# EAGLE schematic Thomas (EAGLE 7.6.0)
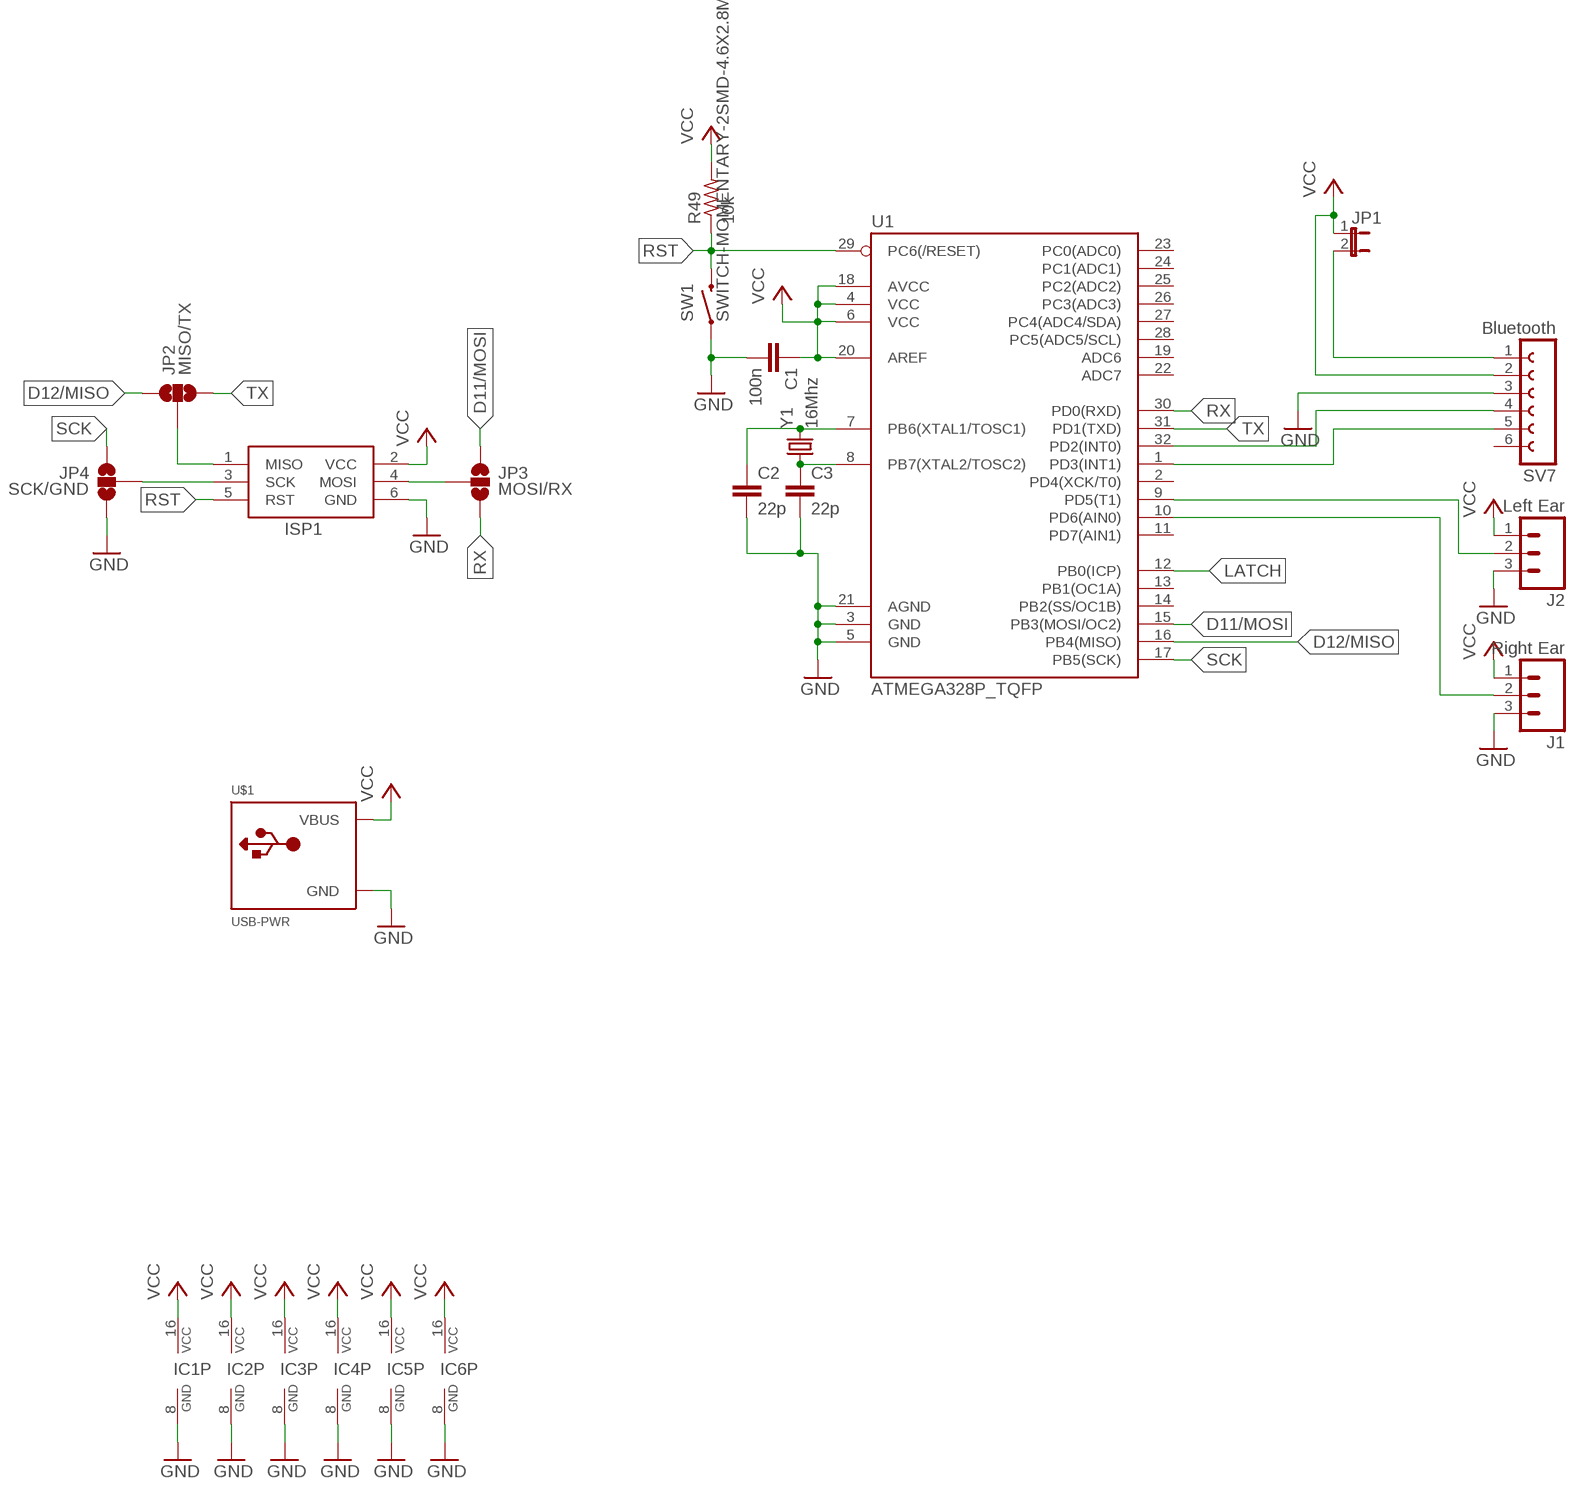
[diagram p0: schematic, sheet 1, part 1 of 2]
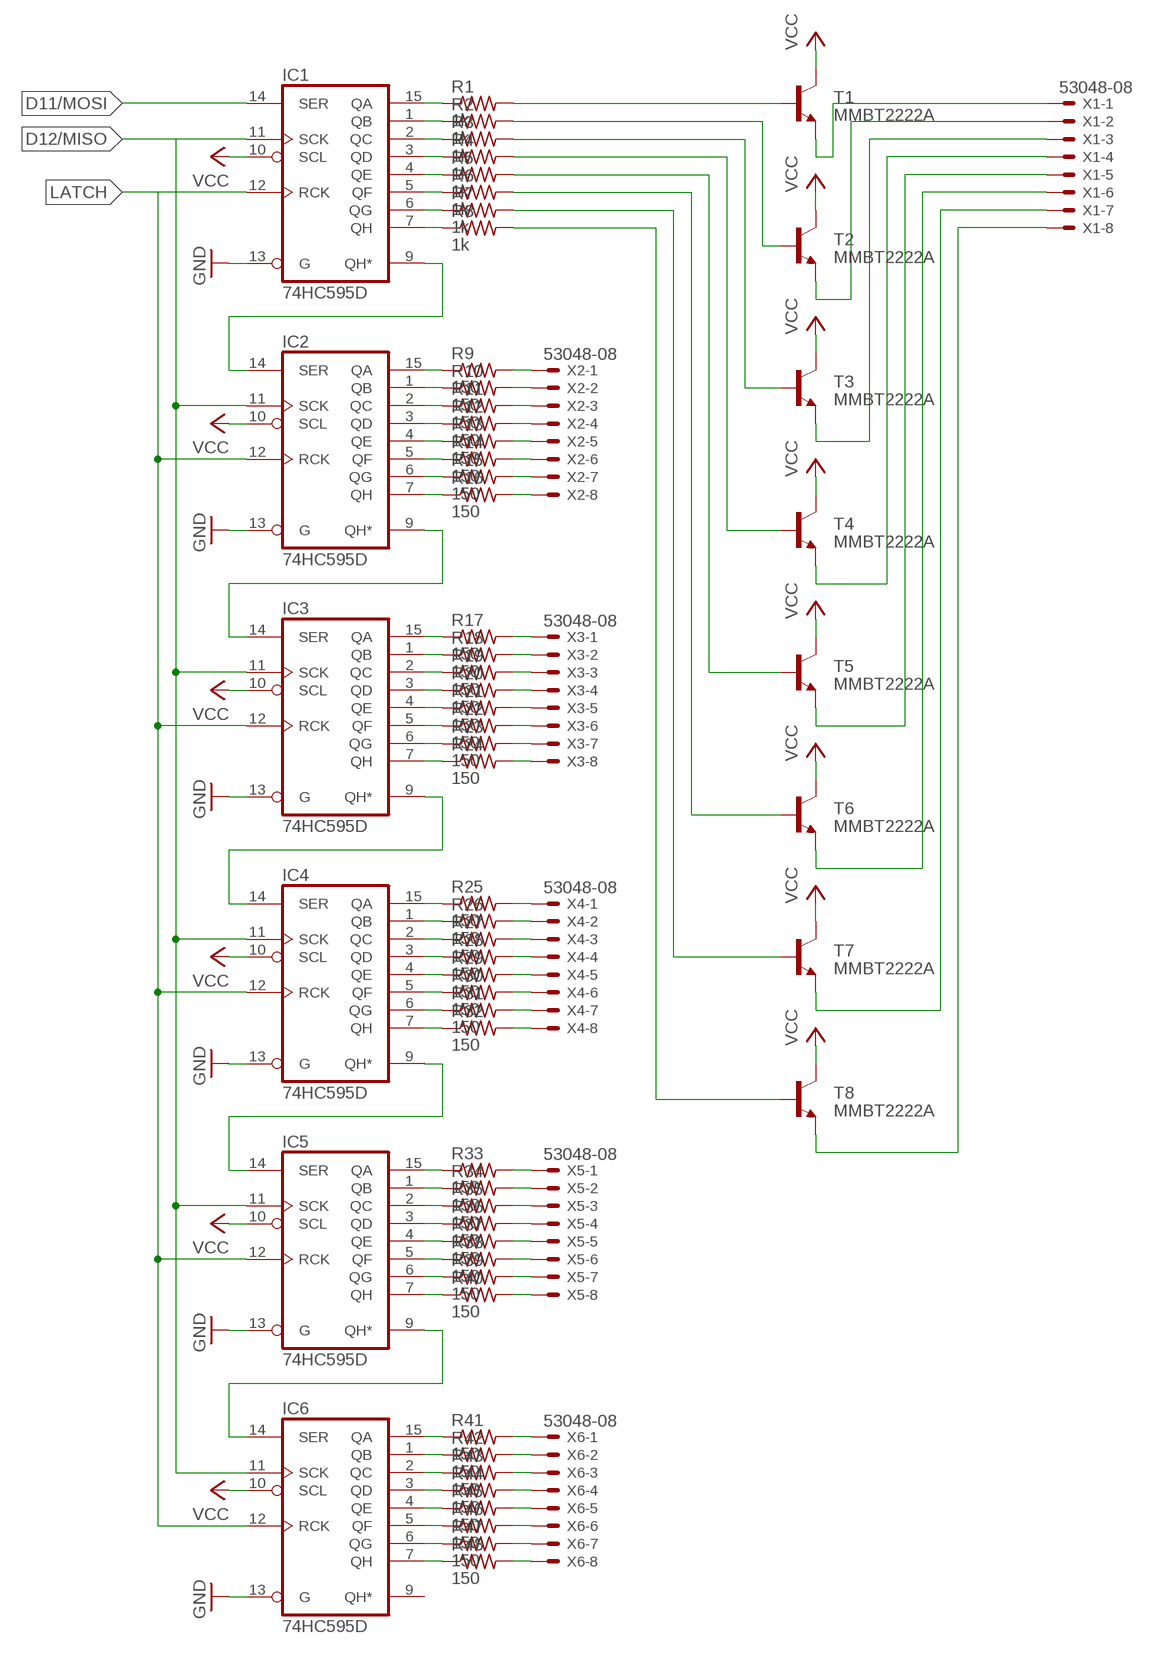
[diagram p1: schematic, sheet 1, part 2 of 2]

## Parts
C1  100n  C-EUC0805K  [C0805K]
C2  22p  C-EUC0805K  [C0805K]
C3  22p  C-EUC0805K  [C0805K]
IC1  74HC595D  [SO16]
IC2  74HC595D  [SO16]
IC3  74HC595D  [SO16]
IC4  74HC595D  [SO16]
IC5  74HC595D  [SO16]
IC6  74HC595D  [SO16]
ISP1  AVRISP-6  [AVRISP]
J1  Right Ear  M03PTH  [1X03]
J2  Left Ear  M03PTH  [1X03]
JP1  JUMPER-2SMD-NC  [SJ_2S]
JP2  MISO/TX  JUMPER-PAD-3-NOYES_SILK  [PAD-JUMPER-3-NO_YES_SILK]
JP3  MOSI/RX  JUMPER-PAD-3-NOYES_SILK  [PAD-JUMPER-3-NO_YES_SILK]
JP4  SCK/GND  JUMPER-PAD-3-NOYES_SILK  [PAD-JUMPER-3-NO_YES_SILK]
R1  1k  R-US_R0805  [R0805]
R2  1k  R-US_R0805  [R0805]
R3  1k  R-US_R0805  [R0805]
R4  1k  R-US_R0805  [R0805]
R5  1k  R-US_R0805  [R0805]
R6  1k  R-US_R0805  [R0805]
R7  1k  R-US_R0805  [R0805]
R8  1k  R-US_R0805  [R0805]
R9  150  R-US_R0805  [R0805]
R10  150  R-US_R0805  [R0805]
R11  150  R-US_R0805  [R0805]
R12  150  R-US_R0805  [R0805]
R13  150  R-US_R0805  [R0805]
R14  150  R-US_R0805  [R0805]
R15  150  R-US_R0805  [R0805]
R16  150  R-US_R0805  [R0805]
R17  150  R-US_R0805  [R0805]
R18  150  R-US_R0805  [R0805]
R19  150  R-US_R0805  [R0805]
R20  150  R-US_R0805  [R0805]
R21  150  R-US_R0805  [R0805]
R22  150  R-US_R0805  [R0805]
R23  150  R-US_R0805  [R0805]
R24  150  R-US_R0805  [R0805]
R25  150  R-US_R0805  [R0805]
R26  150  R-US_R0805  [R0805]
R27  150  R-US_R0805  [R0805]
R28  150  R-US_R0805  [R0805]
R29  150  R-US_R0805  [R0805]
R30  150  R-US_R0805  [R0805]
R31  150  R-US_R0805  [R0805]
R32  150  R-US_R0805  [R0805]
R33  150  R-US_R0805  [R0805]
R34  150  R-US_R0805  [R0805]
R35  150  R-US_R0805  [R0805]
R36  150  R-US_R0805  [R0805]
R37  150  R-US_R0805  [R0805]
R38  150  R-US_R0805  [R0805]
R39  150  R-US_R0805  [R0805]
R40  150  R-US_R0805  [R0805]
R41  150  R-US_R0805  [R0805]
R42  150  R-US_R0805  [R0805]
R43  150  R-US_R0805  [R0805]
R44  150  R-US_R0805  [R0805]
R45  150  R-US_R0805  [R0805]
R46  150  R-US_R0805  [R0805]
R47  150  R-US_R0805  [R0805]
R48  150  R-US_R0805  [R0805]
R49  10k  R-US_R0805  [R0805]
SV7  Bluetooth  FE06-1  [FE06]
SW1  SWITCH-MOMENTARY-2SMD-4.6X2.8MM  [TACTILE_SWITCH_SMD_4.6X2.8MM]
T1  MMBT2222A  TRANSISTOR_NPNMMBT2222A  [SOT23-3]
T2  MMBT2222A  TRANSISTOR_NPNMMBT2222A  [SOT23-3]
T3  MMBT2222A  TRANSISTOR_NPNMMBT2222A  [SOT23-3]
T4  MMBT2222A  TRANSISTOR_NPNMMBT2222A  [SOT23-3]
T5  MMBT2222A  TRANSISTOR_NPNMMBT2222A  [SOT23-3]
T6  MMBT2222A  TRANSISTOR_NPNMMBT2222A  [SOT23-3]
T7  MMBT2222A  TRANSISTOR_NPNMMBT2222A  [SOT23-3]
T8  MMBT2222A  TRANSISTOR_NPNMMBT2222A  [SOT23-3]
U1  ATMEGA328P_TQFP  [TQFP32-08]
U$1  USB-PWR  [USB-MINIB-THM-MOLEX-PWRONLY]
X1  53048-08  [53048-08]
X2  53048-08  [53048-08]
X3  53048-08  [53048-08]
X4  53048-08  [53048-08]
X5  53048-08  [53048-08]
X6  53048-08  [53048-08]
Y1  16Mhz  CRYSTAL3.2X1.5MM  [CRYSTAL-SMD-3.2X1.5MM]

## Nets
D11/MOSI: IC1.14(SER) JP3.1 U1.15(PB3(MOSI/OC2))
D12/MISO: IC1.11(SCK) IC2.11(SCK) IC3.11(SCK) IC4.11(SCK) IC5.11(SCK) IC6.11(SCK) JP2.1 U1.16(PB4(MISO))
GND: C1.2 C2.2 C3.2 IC1.8(GND) IC1.13(G) IC2.8(GND) IC2.13(G) IC3.8(GND) IC3.13(G) IC4.8(GND) IC4.13(G) IC5.8(GND) IC5.13(G) IC6.8(GND) IC6.13(G) ISP1.6(GND) J1.3 J2.3 JP4.3 SV7.3 SW1.1 SW1.2 U1.3(GND) U1.5(GND) U1.21(AGND) U$1.GND
LATCH: IC1.12(RCK) IC2.12(RCK) IC3.12(RCK) IC4.12(RCK) IC5.12(RCK) IC6.12(RCK) U1.12(PB0(ICP))
N$1: IC1.9(QH*) IC2.14(SER)
N$2: IC2.9(QH*) IC3.14(SER)
N$3: IC3.9(QH*) IC4.14(SER)
N$4: IC4.9(QH*) IC5.14(SER)
N$5: IC5.9(QH*) IC6.14(SER)
N$6: R41.2 X6.1
N$7: R42.2 X6.2
N$8: R43.2 X6.3
N$9: R44.2 X6.4
N$10: R45.2 X6.5
N$11: R46.2 X6.6
N$12: R47.2 X6.7
N$13: R48.2 X6.8
N$14: R33.2 X5.1
N$15: R34.2 X5.2
N$16: R35.2 X5.3
N$17: R36.2 X5.4
N$18: R37.2 X5.5
N$19: R38.2 X5.6
N$20: R39.2 X5.7
N$21: R40.2 X5.8
N$22: R25.2 X4.1
N$23: R26.2 X4.2
N$24: R27.2 X4.3
N$25: R28.2 X4.4
N$26: R29.2 X4.5
N$27: R30.2 X4.6
N$28: R31.2 X4.7
N$29: R32.2 X4.8
N$30: R17.2 X3.1
N$31: R18.2 X3.2
N$32: R19.2 X3.3
N$33: R20.2 X3.4
N$34: R21.2 X3.5
N$35: R22.2 X3.6
N$36: R23.2 X3.7
N$37: R24.2 X3.8
N$38: R9.2 X2.1
N$39: R10.2 X2.2
N$40: R11.2 X2.3
N$41: R12.2 X2.4
N$42: R13.2 X2.5
N$43: R14.2 X2.6
N$44: R15.2 X2.7
N$45: R16.2 X2.8
N$46: JP1.2 SV7.1
N$47: SV7.4 U1.32(PD2(INT0))
N$48: IC2.15(QA) R9.1
N$49: IC2.1(QB) R10.1
N$50: IC2.2(QC) R11.1
N$51: IC2.3(QD) R12.1
N$52: IC2.4(QE) R13.1
N$53: IC2.5(QF) R14.1
N$54: IC2.6(QG) R15.1
N$55: IC2.7(QH) R16.1
N$56: IC3.15(QA) R17.1
N$57: IC3.1(QB) R18.1
N$58: IC3.2(QC) R19.1
N$59: IC3.3(QD) R20.1
N$60: IC3.4(QE) R21.1
N$61: IC3.5(QF) R22.1
N$62: IC3.6(QG) R23.1
N$63: IC3.7(QH) R24.1
N$64: IC4.15(QA) R25.1
N$65: IC4.1(QB) R26.1
N$66: IC4.2(QC) R27.1
N$67: IC4.3(QD) R28.1
N$68: IC4.4(QE) R29.1
N$69: IC4.5(QF) R30.1
N$70: IC4.6(QG) R31.1
N$71: IC4.7(QH) R32.1
N$72: IC5.15(QA) R33.1
N$73: IC5.1(QB) R34.1
N$74: IC5.2(QC) R35.1
N$75: IC5.3(QD) R36.1
N$76: IC5.4(QE) R37.1
N$77: IC5.5(QF) R38.1
N$78: IC5.6(QG) R39.1
N$79: IC5.7(QH) R40.1
N$80: IC6.15(QA) R41.1
N$81: IC6.1(QB) R42.1
N$82: IC6.2(QC) R43.1
N$83: IC6.3(QD) R44.1
N$84: IC6.4(QE) R45.1
N$85: IC6.5(QF) R46.1
N$86: IC6.6(QG) R47.1
N$87: IC6.7(QH) R48.1
N$88: IC1.15(QA) R1.1
N$89: IC1.1(QB) R2.1
N$90: IC1.2(QC) R3.1
N$91: IC1.3(QD) R4.1
N$92: IC1.4(QE) R5.1
N$93: IC1.5(QF) R6.1
N$94: IC1.6(QG) R7.1
N$95: IC1.7(QH) R8.1
N$96: R1.2 T1.1(B)
N$97: R2.2 T2.1(B)
N$98: R3.2 T3.1(B)
N$99: R4.2 T4.1(B)
N$100: R5.2 T5.1(B)
N$101: R6.2 T6.1(B)
N$102: R7.2 T7.1(B)
N$103: R8.2 T8.1(B)
N$104: T1.2(E) X1.1
N$105: T2.2(E) X1.2
N$106: T3.2(E) X1.3
N$107: T4.2(E) X1.4
N$108: T5.2(E) X1.5
N$109: T6.2(E) X1.6
N$110: T7.2(E) X1.7
N$111: T8.2(E) X1.8
N$112: SV7.5 U1.1(PD3(INT1))
N$113: C2.1 U1.7(PB6(XTAL1/TOSC1)) Y1.P$2
N$114: C3.1 U1.8(PB7(XTAL2/TOSC2)) Y1.P$1
N$115: J2.2 U1.9(PD5(T1))
N$116: J1.2 U1.10(PD6(AIN0))
N$117: ISP1.1(MISO) JP2.2
N$118: ISP1.3(SCK) JP4.2
N$119: ISP1.4(MOSI) JP3.2
RST: ISP1.5(RST) R49.1 SW1.3 SW1.4 U1.29(PC6(/RESET))
RX: JP3.3 U1.30(PD0(RXD))
SCK: JP4.1 U1.17(PB5(SCK))
TX: JP2.3 U1.31(PD1(TXD))
VCC: C1.1 IC1.10(SCL) IC1.16(VCC) IC2.10(SCL) IC2.16(VCC) IC3.10(SCL) IC3.16(VCC) IC4.10(SCL) IC4.16(VCC) IC5.10(SCL) IC5.16(VCC) IC6.10(SCL) IC6.16(VCC) ISP1.2(VCC) J1.1 J2.1 JP1.1 R49.2 SV7.2 T1.3(C) T2.3(C) T3.3(C) T4.3(C) T5.3(C) T6.3(C) T7.3(C) T8.3(C) U1.4(VCC) U1.6(VCC) U1.18(AVCC) U1.20(AREF) U$1.VBUS
Unconnected: IC6.9(QH*) SV7.6 U1.2(PD4(XCK/T0)) U1.11(PD7(AIN1)) U1.13(PB1(OC1A)) U1.14(PB2(SS/OC1B)) U1.19(ADC6) U1.22(ADC7) U1.23(PC0(ADC0)) U1.24(PC1(ADC1)) U1.25(PC2(ADC2)) U1.26(PC3(ADC3)) U1.27(PC4(ADC4/SDA)) U1.28(PC5(ADC5/SCL))

## Library data of the parts
C1-C3 = resistor:C-EU: CAPACITOR, European symbol
IC1-IC6 = 74xx-eu:74*595: 8-bit SHIFT REGISTER, output latch
ISP1 = adafruit:AVRISP: AVR ISP HEADER Standard 6 pin header for AVR programming
J1 J2 = SparkFun-Connectors:M03: Header 3 Standard 3-pin 0.1" header. Use with straight break away headers (SKU : PRT-00116), right angle break away headers (PRT-00553), swiss pins (PRT-00743), machine pins (PRT-00117), and female headers (PRT-00115). Molex polarized connector foot print use with SKU : PRT-08232 with associated crimp pins and housings.
JP1 = SparkFun-Retired:JUMPER-2: Jumper Basic 0.1" spaced jumper. Use with breakaway headers.
JP2-JP4 = SparkFun-Passives:JUMPER-PAD-3-NO
R1-R49 = rcl:R-US_: RESISTOR, American symbol
SV7 = con-lsta:FE06-1: FEMALE HEADER; OC_FARNELL: unknown; OC_NEWARK: unknown
SW1 = SparkFun-Electromechanical:SWITCH-MOMENTARY-2: Various NO switches- pushbuttons, reed, etc; PROD_ID: SWCH-13065
T1-T8 = SparkFun-DiscreteSemi:TRANSISTOR_NPN: Generic NPN BJT MMBT2222A - TRANS-08049 (SOT-23, 1A 40V) MPSA42 - TRANS-09116 (SOT-23, 500mA 300V) MMBT5088LT1G - TRANS-11160 (SOT-23, 50 mA 30V) BC547 - COM-08928 <http://www.sparkfun.com/products/8928> (TO-92 45V 100mA) (1.Collector 2.Base 3.Emitter) 2N3904 - COM-00521 <http://www.sparkfun.com/products/521> (TO-92 40V 200mA) (1.Emitter 2.Base 3.Collector) P2N2222A - COM-12852 <http://www.sparkfun.com/products/12852> (TO-92 40V 600mA) (1.Collector 2.Base 3.Emitter); PROD_ID: TRANS-08049
U1 = SparkFun-DigitalIC:ATMEGA328P_TQFP; PROD_ID: IC-09069
U$1 = adafruit:USB-PWR
X1-X6 = con-molex:53?-08: CONNECTOR wire to board 1.25 mm (.049 inch) pitch header; MF: WALDOM/MOLEX; MPN: 53048-0810; OC_FARNELL: 9733094; OC_NEWARK: 38C9913
Y1 = SparkFun-FreqCtrl:CRYSTAL: Various standard crystals. Proven footprints.; PROD_ID: XTAL-13062; VALUE: 32.768kHz